# EAGLE design sx-wdec1-2313 (EAGLE 6.1)
Selectrix Arduino
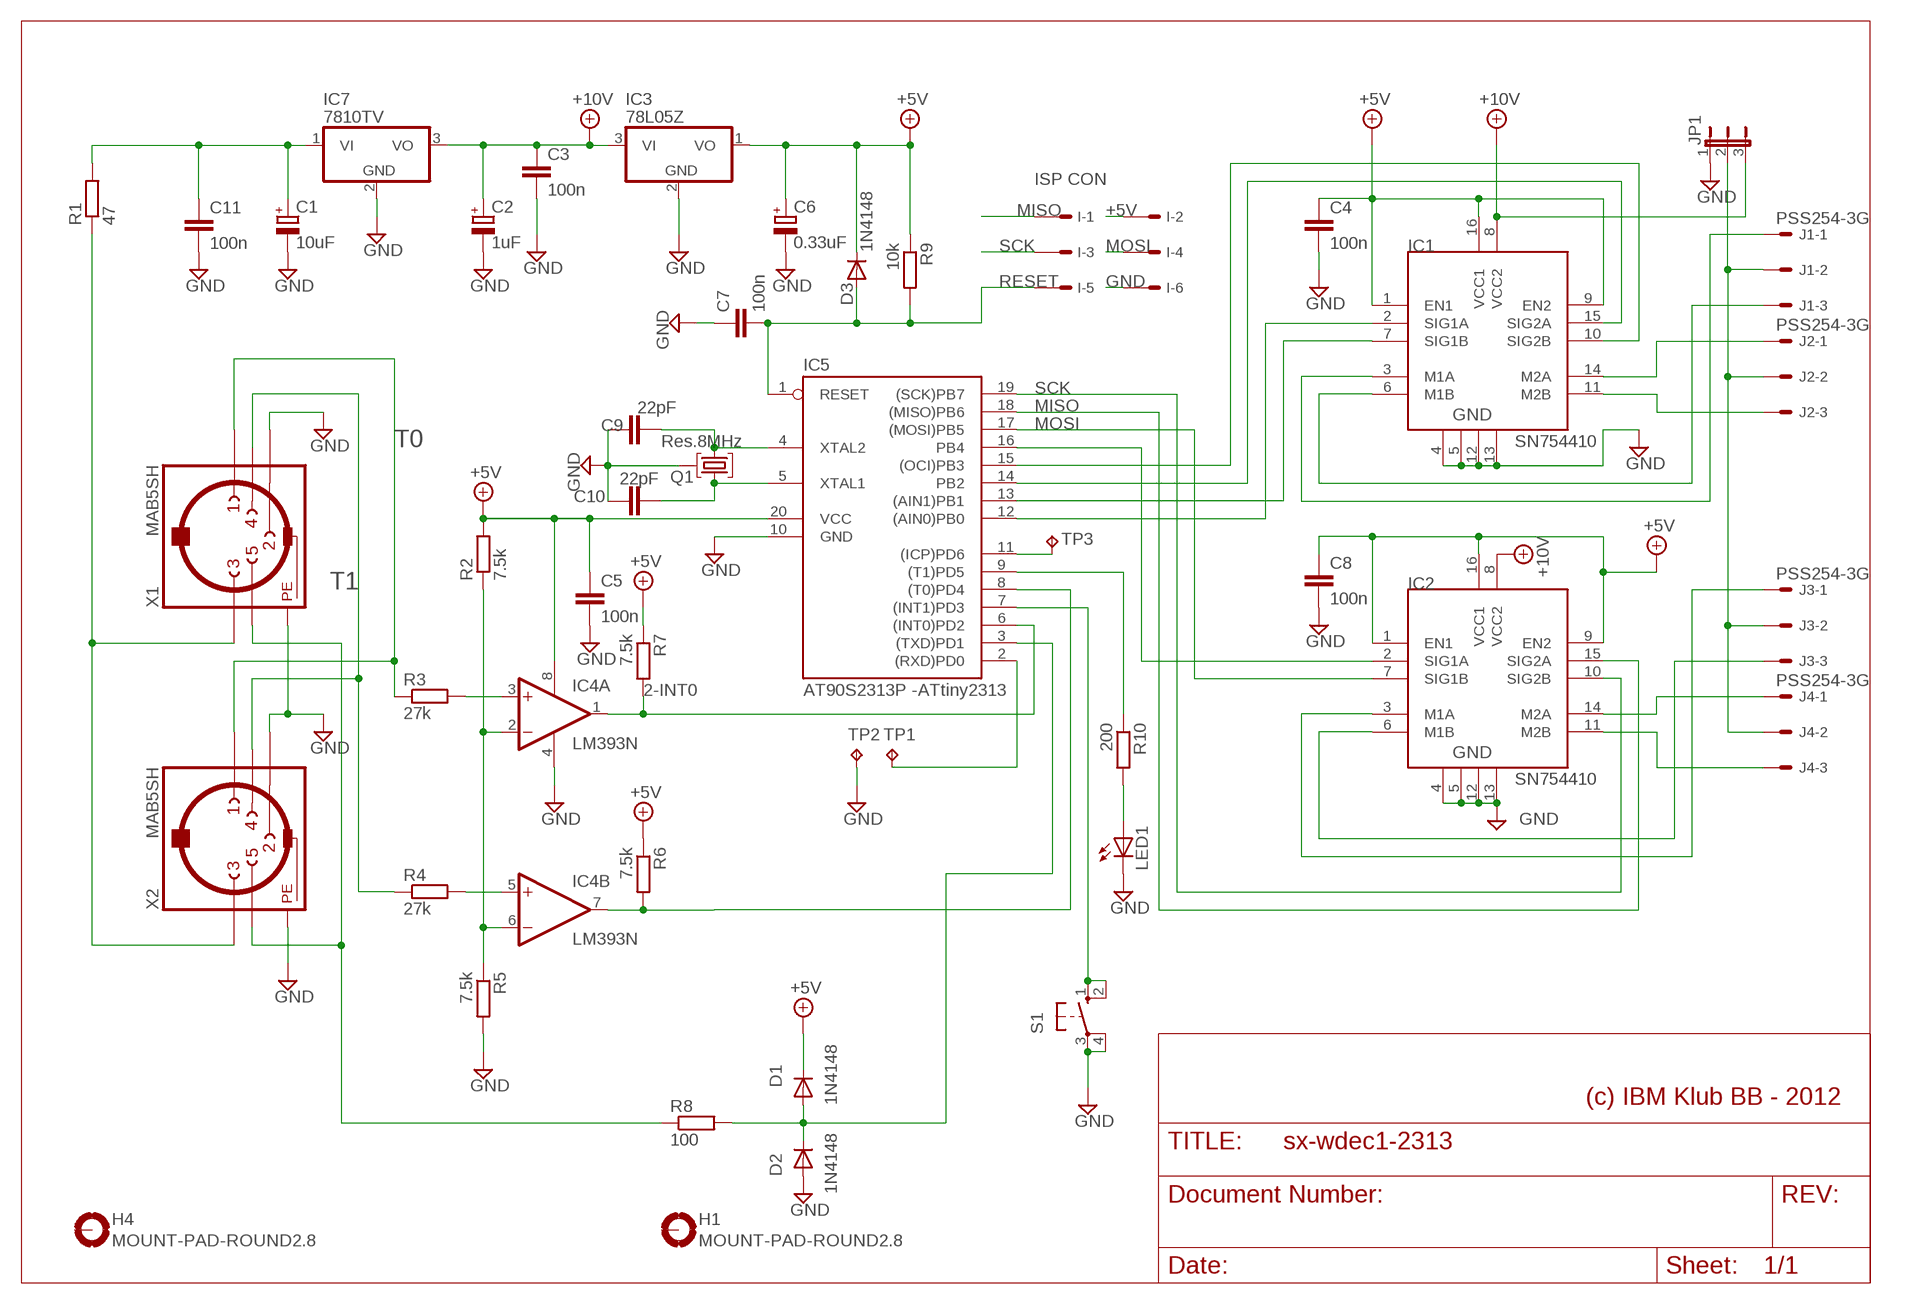
[diagram p0: schematic, sheet 1]

## Parts
C1  10uF  CPOL-EUE2.5-7  [E2,5-7]
C2  1uF  CPOL-EUE2.5-7  [E2,5-7]
C3  100n  C-EU050-025X075  [C050-025X075]
C4  100n  C-EU050-025X075  [C050-025X075]
C5  100n  C-EU050-025X075  [C050-025X075]
C6  0.33uF  CPOL-EUE2.5-5  [E2,5-5]
C7  100n  C-EU050-025X075  [C050-025X075]
C8  100n  C-EU050-025X075  [C050-025X075]
C9  22pF  C-EU025-025X050  [C025-025X050]
C10  22pF  C-EU025-025X050  [C025-025X050]
C11  100n  C-EU050-025X075  [C050-025X075]
D1  1N4148  1N4148DO35-7  [DO35-7]
D2  1N4148  1N4148DO35-7  [DO35-7]
D3  1N4148  1N4148DO35-7  [DO35-7]
H1  MOUNT-PAD-ROUND2.8  [2,8-PAD]
H4  MOUNT-PAD-ROUND2.8  [2,8-PAD]
I  ISP CON  057-006-1  [057-006-1]
IC1  SN754410  [DIP16]
IC2  SN754410  [DIP16]
IC3  78L05Z  [TO92]
IC4  LM393N  [DIL08]
IC5  AT90S2313P -ATtiny2313  AT90S2313P  [DIL20]
IC7  7810TV  7812TV  [TO220V]
J1  PSS254-3G  22-27-2031-03  [6410-03]
J2  PSS254-3G  22-27-2031-03  [6410-03]
J3  PSS254-3G  22-27-2031-03  [6410-03]
J4  PSS254-3G  22-27-2031-03  [6410-03]
JP1  JP2E  [JP2]
LED1  LED3MM  [LED3MM]
Q1  Res.8MHz  ECSECS-10.7-15A  [HC49U]
R1  47  R-EU_0207/12  [0207/12]
R2  7.5k  R-EU_0207/10  [0207/10]
R3  27k  R-EU_0207/10  [0207/10]
R4  27k  R-EU_0207/10  [0207/10]
R5  7.5k  R-EU_0207/10  [0207/10]
R6  7.5k  R-EU_0207/10  [0207/10]
R7  7.5k  R-EU_0207/10  [0207/10]
R8  100  R-EU_0207/10  [0207/10]
R9  10k  R-EU_0207/10  [0207/10]
R10  200  R-EU_0207/10  [0207/10]
S1  10-XX  [B3F-10XX]
TP1  TPPAD1-13  [P1-13]
TP2  TPPAD1-13  [P1-13]
TP3  TPPAD1-13  [P1-13]
X1  MAB5SH  [MAB5SH]
X2  MAB5SH  [MAB5SH]

## Nets
2-INT0: IC4.1(A:OUT) IC5.6((INT0)PD2) R7.2
4: IC4.7(B:OUT) IC5.8((T0)PD4) R6.2
6: IC1.15(SIG2A) IC5.14(PB2)
9: IC1.10(SIG2B) IC5.15((OCI)PB3)
10: IC2.2(SIG1A) IC5.16(PB4)
+5V: C4.1 C5.1 C6.+ C8.1 D1.C D3.C I.2 IC1.1(EN1) IC1.9(EN2) IC1.16(VCC1) IC2.1(EN1) IC2.9(EN2) IC2.16(VCC1) IC3.1(VO) IC4.8(P:V+) IC5.20(VCC) R2.2 R6.1 R7.1 R9.1
+10V: C2.+ C3.1 IC1.8(VCC2) IC2.8(VCC2) IC3.3(VI) IC7.3(VO) JP1.3
GND: C1.- C2.- C3.2 C4.2 C5.2 C6.- C7.1 C8.2 C9.1 C10.1 C11.2 D2.A I.6 IC1.4 IC1.5 IC1.12 IC1.13 IC2.4 IC2.5 IC2.12 IC2.13 IC3.2(GND) IC4.4(P:V-) IC5.10(GND) IC7.2(GND) JP1.1 LED1.K(C) Q1.2 R5.2 S1.3(P) S1.4(P1) TP2.TP X1.2 X1.PE X1.PE@(PE) X2.2 X2.PE X2.PE@(PE)
MISO: I.1 IC2.15(SIG2A) IC5.18((MISO)PB6)
MOSI: I.4 IC2.7(SIG1B) IC5.17((MOSI)PB5)
N$1: R1.1 X1.3 X2.3
N$2: C1.+ C11.1 IC7.1(VI) R1.2
N$3: R8.1 X1.5 X2.5
N$4: IC4.3(A:+IN) R3.2
N$5: IC4.5(B:+IN) R4.2
N$6: D1.A D2.C IC5.3((TXD)PD1) R8.2
N$7: IC4.2(A:-IN) IC4.6(B:-IN) R2.1 R5.1
N$8: IC1.2(SIG1A) IC5.12((AIN0)PB0)
N$9: IC1.3(M1A) J1.1
N$10: IC1.6(M1B) J1.3
N$11: IC1.14(M2A) J2.1
N$12: IC1.11(M2B) J2.3
N$13: IC2.3(M1A) J3.1
N$14: IC2.6(M1B) J3.3
N$15: IC2.14(M2A) J4.1
N$16: IC2.11(M2B) J4.3
N$17: C9.2 IC5.4(XTAL2) Q1.1
N$18: C10.2 IC5.5(XTAL1) Q1.3
N$19: IC1.7(SIG1B) IC5.13((AIN1)PB1)
N$20: IC5.2((RXD)PD0) TP1.TP
N$21: IC5.7((INT1)PD3) S1.1(S) S1.2(S1)
N$22: J1.2 J2.2 J3.2 J4.2 JP1.2
N$23: IC5.9((T1)PD5) R10.1
N$24: LED1.A R10.2
N$25: IC5.11((ICP)PD6) TP3.TP
RESET: C7.2 D3.A I.5 IC5.1(RESET) R9.2
SCK: I.3 IC2.10(SIG2B) IC5.19((SCK)PB7)
T0: R3.1 X1.1 X2.1
T1: R4.1 X1.4 X2.4
Unconnected: H1.B2,8(MOUNT) H4.B2,8(MOUNT)

## Notes on the sheet
- (c) IBM Klub BB - 2012

## Library data of the parts
C1 C2 C6 = rcl:CPOL-EU: POLARIZED CAPACITOR, European symbol
C3-C5 C7-C11 = rcl:C-EU: CAPACITOR, European symbol
D1-D3 = diode:1N4148: DIODE high speed (Philips)
H1 H4 = holes:MOUNT-PAD-ROUND: MOUNTING PAD, round
I = con-panduit:057-006-: CONNECTOR 6-pin series 057 contact pc board low profile headers; OC_FARNELL: unknown; OC_NEWARK: unknown
IC1 IC2 = HBridge:SN754410: Quadruple half-H driver
IC3 IC7 = linear:78*: Positive VOLTAGE REGULATOR Source: http://cache.national.com/ds/LM/LM78L05.pdf http://www.fairchildsemi.com/ds/LM/LM7805.pdf
IC4 = linear:LM393: COMPARATOR
IC5 = atmel:AT90S2313: MICROCONTROLLER 2 Kbytes FLASH 128 bytes SRAM 128 bytes EEPROM UART; OC_FARNELL: unknown; OC_NEWARK: unknown
J1-J4 = con-molex:22-?-03: CONNECTOR wire to board 2.54 mm (.1 inch) pitch header; OC_FARNELL: unknown; OC_NEWARK: unknown
JP1 = jumper:JP2E: JUMPER
LED1 = led:LED: LED OSRAM: - CHIPLED LG R971, LG N971, LY N971, LG Q971, LY Q971, LO R971, LY R971 LH N974, LH R974 LS Q976, LO Q976, LY Q976 LO Q996 - Hyper CHIPLED LW Q18S LB Q993, LB Q99A, LB R99A - SideLED LS A670, LO A670, LY A670, LG A670, LP A670 LB A673, LV A673, LT A673, LW A673 LH A674 LY A675 LS A676, LA A676, LO A676, LY A676, LW A676 LS A679, LY A679, LG A679 - Hyper Micro SIDELED® LS Y876, LA Y876, LO Y876, LY Y876 LT Y87S - SmartLED LW L88C, LW L88S LB L89C, LB L89S, LG L890 LS L89K, LO L89K, LY L89K LS L896, LA L896, LO L896, LY L896 - TOPLED LS T670, LO T670, LY T670, LG T670, LP T670 LSG T670, LSP T670, LSY T670, LOP T670, LYG T670 LG T671, LOG T671, LSG T671 LB T673, LV T673, LT T673, LW T673 LH T674 LS T676, LA T676, LO T676, LY T676, LB T676, LH T676, LSB T676, LW T676 LB T67C, LV T67C, LT T67C, LS T67K, LO T67K, LY T67K, LW E67C LS E67B, LA E67B, LO E67B, LY E67B, LB E67C, LV E67C, LT E67C LW T67C LS T679, LY T679, LG T679 LS T770, LO T770, LY T770, LG T770, LP T770 LB T773, LV T773, LT T773, LW T773 LH T774 LS E675, LA E675, LY E675, LS T675 LS T776, LA T776, LO T776, LY T776, LB T776 LHGB T686 LT T68C, LB T68C - Hyper Mini TOPLED® LB M676 - Mini TOPLED Santana® LG M470 LS M47K, LO M47K, LY M47K Source: http://www.osram.convergy.de LUXEON: - LUMILED® LXK2-PW12-R00, LXK2-PW12-S00, LXK2-PW14-U00, LXK2-PW14-V00 LXK2-PM12-R00, LXK2-PM12-S00, LXK2-PM14-U00 LXK2-PE12-Q00, LXK2-PE12-R00, LXK2-PE12-S00, LXK2-PE14-T00, LXK2-PE14-U00 LXK2-PB12-K00, LXK2-PB12-L00, LXK2-PB12-M00, LXK2-PB14-N00, LXK2-PB14-P00, LXK2-PB14-Q00 LXK2-PR12-L00, LXK2-PR12-M00, LXK2-PR14-Q00, LXK2-PR14-R00 LXK2-PD12-Q00, LXK2-PD12-R00, LXK2-PD12-S00 LXK2-PH12-R00, LXK2-PH12-S00 LXK2-PL12-P00, LXK2-PL12-Q00, LXK2-PL12-R00 Source: www.luxeon.com KINGBRIGHT: KA-3528ASYC Source: www.kingbright.com
Q1 = crystal:ECS: MONOLITHIC CRYSTAL FILTERS Source: http://www.presto.co.uk; OC_FARNELL: unknown; OC_NEWARK: unknown
R1-R10 = rcl:R-EU_: RESISTOR, European symbol
S1 = switch-omron:10-XX: OMRON SWITCH; MPN: B3F-1000; OC_FARNELL: 176432; OC_NEWARK: 36M3542
TP1-TP3 = testpad:TP: Test pad
X1 X2 = con-hirschmann:MAB5SH: Female CONNECTOR 5 pins 90 deg. with shield, horizontal (DIN 41524); OC_FARNELL: 809883; OC_NEWARK: unknown

## Board
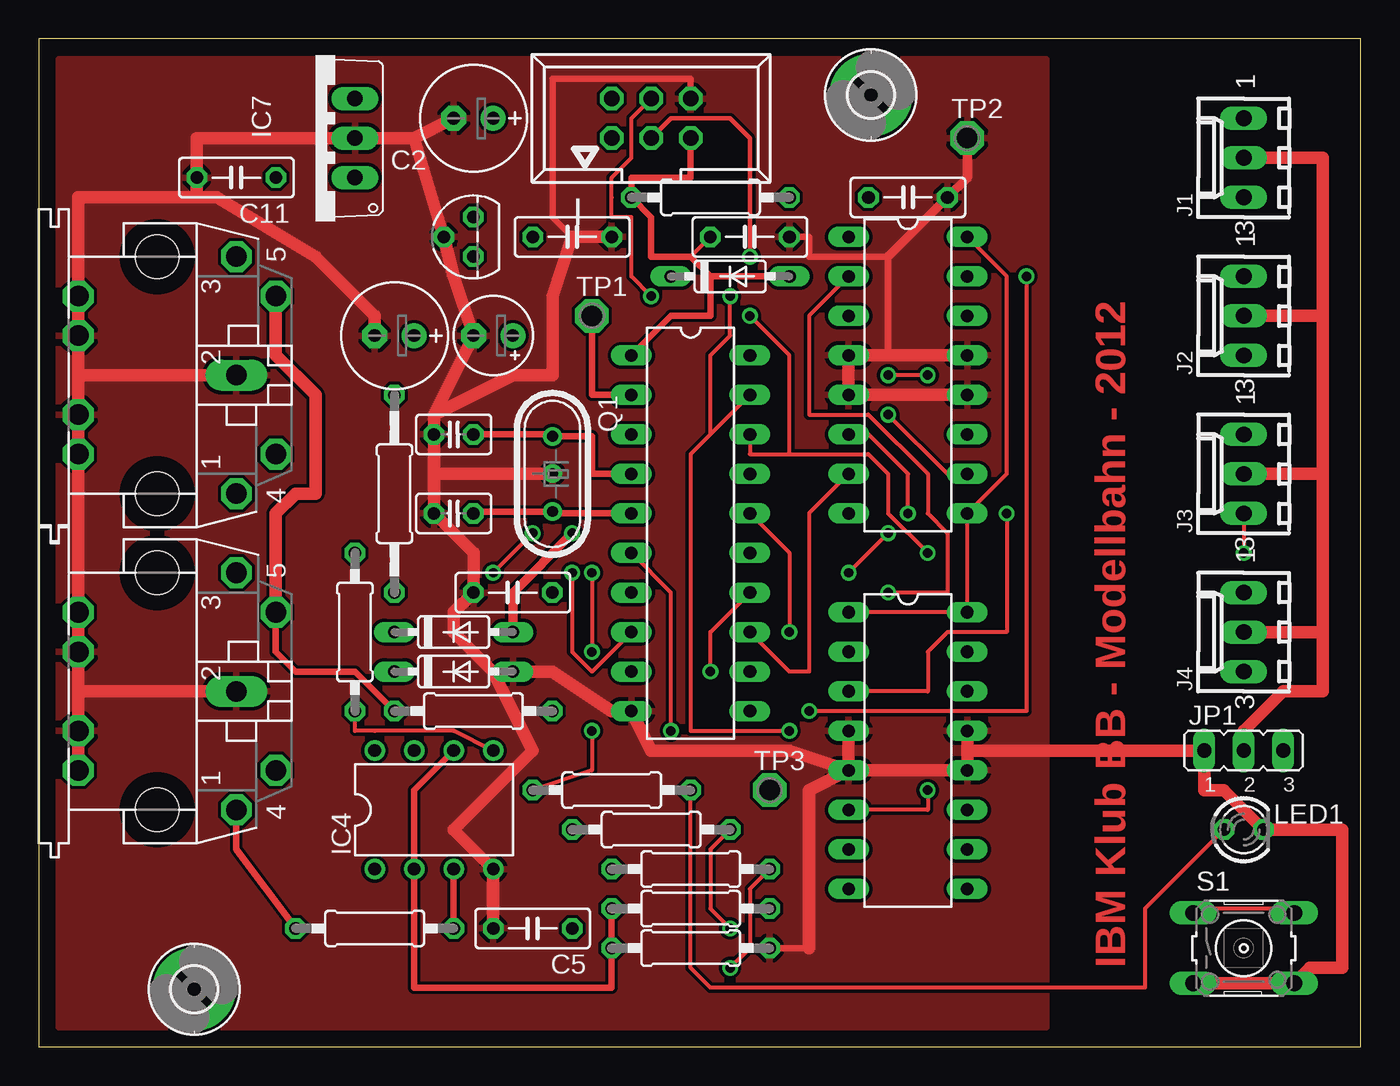
[diagram p1: board, top side]
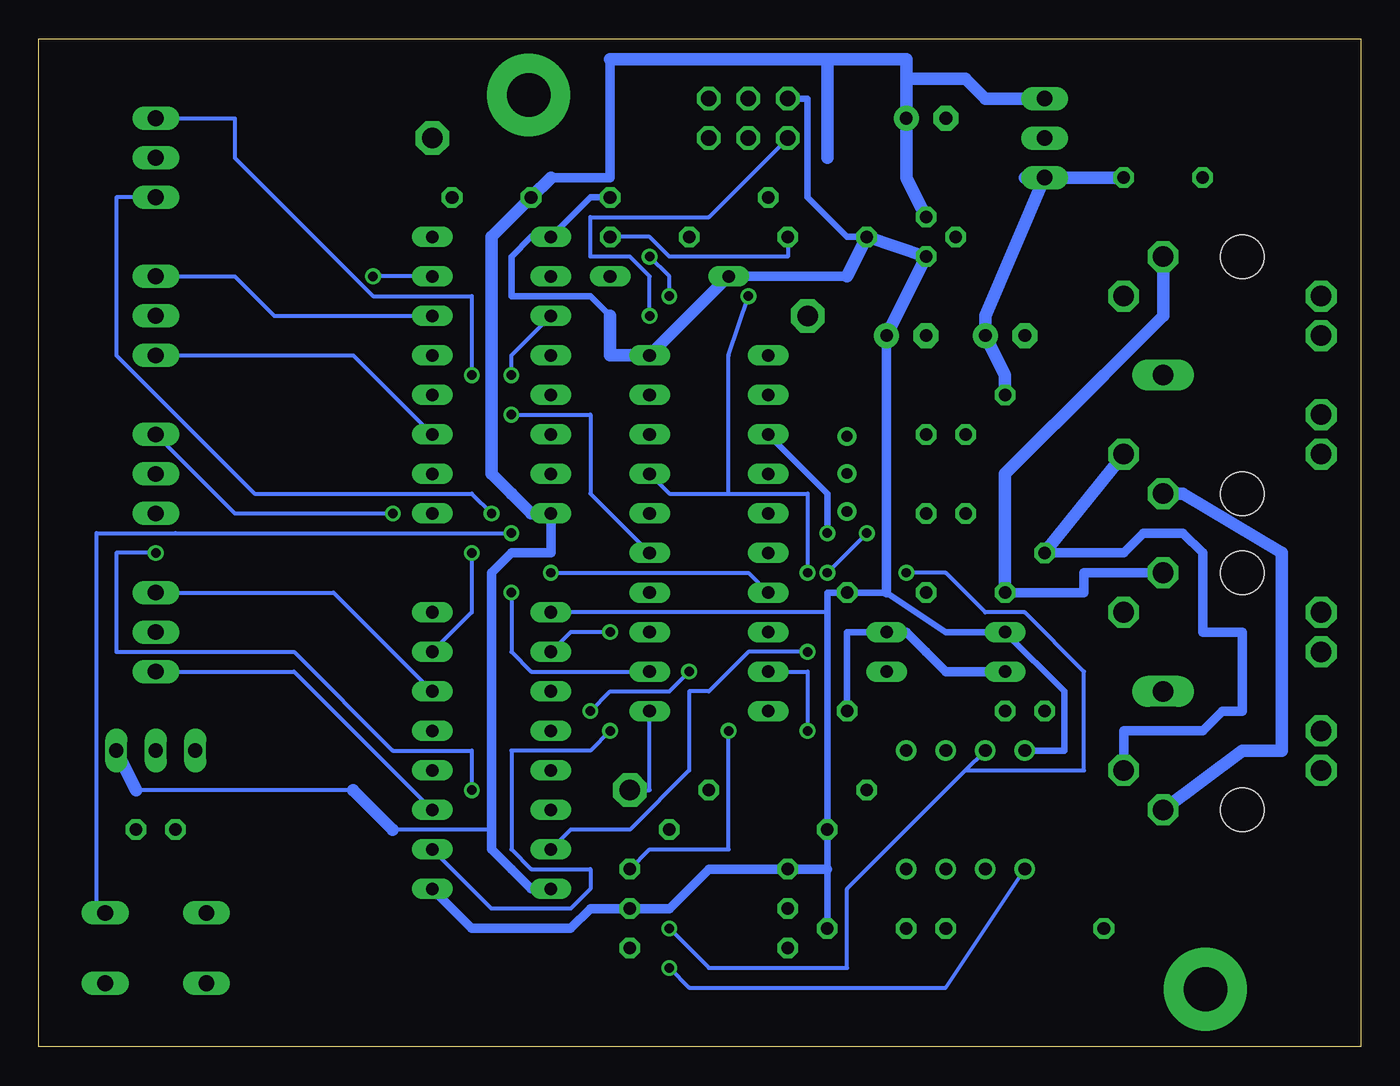
[diagram p2: board, bottom side, seen from below]

Size 84.99 x 64.8 mm. Coordinates in mm from the lower left corner, seen from the top.
Outline: 0,0 84.99,0 84.99,64.8 0,64.8 0,0
Copper layers (1*16): Top 0.035mm / dielectric 1.5mm / Bottom 0.035mm
Design rules: minimum track width 10mil, minimum drill 24mil, track to track 8mil, track to pad 8mil, pad to pad 8mil, via to via 8mil, smd to smd 8mil, copper to edge 40mil, drill to drill 8mil, minimum pad ring 10mil, minimum via ring 8mil, stop-mask expansion 4mil, vias tented up to drill 0mil, thermal gap 10mil

### Footprints (pad centres in the part's own frame; a part is rotated, then mirrored left to right if it is on the bottom)
E2,5-7 = drill 0.813 pad 1.6: + -1.27,0 | drill 0.813 pad 1.6 octagon: - 1.27,0
C050-025X075 = drill 0.813 octagon: 1 -2.54,0; 2 2.54,0
E2,5-5 = drill 0.813 pad 1.6: + -1.27,0 | drill 0.813 pad 1.6 octagon: - 1.27,0
C025-025X050 = drill 0.813 octagon: 1 -1.27,0; 2 1.27,0
DO35-7 = drill 0.813 long: A 3.81,0; C -3.81,0
2,8-PAD = drill 2.8 pad 5.334: B2,8 0,0
057-006-1 = drill 1 octagon: 1 -2.54,-1.27; 2 -2.54,1.27; 3 0,-1.27; 4 0,1.27; 5 2.54,-1.27; 6 2.54,1.27
DIP16 = drill 0.813 long: 1 -10.16,-3.81; 2 -7.62,-3.81; 3 -5.08,-3.81; 4 -2.54,-3.81; 5 0,-3.81; 6 2.54,-3.81; 7 5.08,-3.81; 8 7.62,-3.81; 9 7.62,3.81; 10 5.08,3.81; 11 2.54,3.81; 12 0,3.81; 13 -2.54,3.81; 14 -5.08,3.81; 15 -7.62,3.81; 16 -10.16,3.81
TO92 = drill 0.813 octagon: 1 -1.27,0; 2 0,1.905; 3 1.27,0
DIL08 = drill 0.813 pad 1.27: 1 -3.81,-3.81; 2 -1.27,-3.81; 3 1.27,-3.81; 4 3.81,-3.81; 5 3.81,3.81; 6 1.27,3.81; 7 -1.27,3.81; 8 -3.81,3.81
DIL20 = drill 0.813 long: 1 -11.43,-3.81; 2 -8.89,-3.81; 3 -6.35,-3.81; 4 -3.81,-3.81; 5 -1.27,-3.81; 6 1.27,-3.81; 7 3.81,-3.81; 8 6.35,-3.81; 9 8.89,-3.81; 10 11.43,-3.81; 11 11.43,3.81; 12 8.89,3.81; 13 6.35,3.81; 14 3.81,3.81; 15 1.27,3.81; 16 -1.27,3.81; 17 -3.81,3.81; 18 -6.35,3.81; 19 -8.89,3.81; 20 -11.43,3.81
TO220V = drill 1.016 long: 1 -2.54,-2.54; 2 0,-2.54; 3 2.54,-2.54
6410-03 = drill 1.016 long: 1 2.54,0; 2 0,0; 3 -2.54,0
JP2 = drill 0.914 long: 1 -2.54,0; 2 0,0; 3 2.54,0
LED3MM = drill 0.813 octagon: A -1.27,0; K 1.27,0
HC49U = drill 0.7 pad 1.2: 1 -2.413,0; 2 -0.027,0; 3 2.413,0
0207/12 = drill 0.813 octagon: 1 -6.35,0; 2 6.35,0
0207/10 = drill 0.813 octagon: 1 -5.08,0; 2 5.08,0
B3F-10XX = drill 1.016 long: 1 -3.251,2.261; 2 3.251,2.261; 3 -3.251,-2.261; 4 3.251,-2.261
P1-13 = drill 1.321 pad 2.159 octagon: TP 0,0
MAB5SH = drill 1.321 octagon: 1 7.62,5.08; 3 -7.62,5.08; 4 5.08,7.62; 5 -5.08,7.62; PE -2.54,-5.08; PE@ 2.54,-5.08; PE@2 -5.08,-5.08; PE@3 5.08,-5.08 | drill 1.321 long: 2 0,5.08 | hole 2.794: 7.62,0; -7.62,0

### Placement (x,y rotation side)
C1  22.86,45.72 180 top
C2  27.94,59.69 180 top
C3  55.88,54.61 0 top
C4  34.29,52.07 0 top
C5  31.75,7.62 180 top
C6  29.21,45.72 180 top
C7  45.72,52.07 180 top
C8  30.48,29.21 180 top
C9  26.67,39.37 0 top
C10  26.67,34.29 0 top
C11  12.7,55.88 180 top
D1  26.67,26.67 0 top
D2  26.67,24.13 0 top
D3  44.45,49.53 0 top
H1  53.49,61.19 0 top
H4  9.98,3.71 0 top
I  39.37,59.69 0 top
IC1  55.88,41.91 270 top
IC2  55.88,17.78 270 top
IC3  27.94,52.07 90 top
IC4  25.4,15.24 0 top
IC5  41.91,33.02 270 top
IC7  17.78,58.42 90 top
J1  77.47,57.15 90 top
J2  77.47,46.99 90 top
J3  77.47,36.83 90 top
J4  77.47,26.67 90 top
JP1  77.47,19.05 0 top
LED1  77.47,13.97 0 top
Q1  33.02,36.83 270 top
R1  22.86,35.56 90 top
R2  41.91,8.89 0 top
R3  21.59,7.62 0 top
R4  20.32,26.67 270 top
R5  41.91,6.35 0 top
R6  39.37,13.97 0 top
R7  41.91,11.43 0 top
R8  27.94,21.59 0 top
R9  43.18,54.61 180 top
R10  36.83,16.51 0 top
S1  77.47,6.35 0 top
TP1  35.56,46.99 0 top
TP2  59.69,58.42 0 top
TP3  46.99,16.51 0 top
X1  7.62,43.18 270 top
X2  7.62,22.86 270 top

### Tracks (layer width: path | path; a pad name or v marks a point on that pad's centre or on a via)
2-INT0  (via drill 0.61)
  Top 0.254: IC5.6 40.64,29.21 v40.64,20.32 | v44.45,5.08 45.72,6.35 45.72,10.16 R7.2
  Bottom 0.254: R7.2 45.72,12.7 40.64,12.7 v40.64,20.32 | IC4.1 26.67,3.81 43.18,3.81 v44.45,5.08
4  (via drill 0.61)
  Top 0.254: v44.45,7.62 43.18,8.89 43.18,12.7 R6.2 | IC5.8 35.56,24.13 34.29,25.4 v34.29,30.48 | v29.21,30.48 v31.75,33.02
  Bottom 0.254: 25.4,17.78 33.02,10.16 33.02,5.08 41.91,5.08 v44.45,7.62 | 25.4,17.78 IC4.7 | v31.75,33.02 v34.29,30.48 | v29.21,30.48 26.67,30.48 24.13,27.94 21.59,27.94 17.78,24.13 17.78,17.78 25.4,17.78
6  (via drill 0.61)
  Top 0.254: IC5.14 43.18,26.67 v43.18,24.13 | v49.53,21.59 63.5,21.59 v63.5,49.53
  Bottom 0.254: v43.18,24.13 44.45,22.86 48.26,22.86 v49.53,21.59 | IC1.15 v63.5,49.53
9  (via drill 0.61)
  Top 0.254: v54.61,40.64 58.42,36.83 IC1.10
  Bottom 0.254: IC5.15 49.53,35.56 49.53,40.64 v54.61,40.64
10  (via drill 0.61)
  Top 0.254: v48.26,26.67 48.26,31.75 IC5.16
  Bottom 0.254: IC2.2 50.8,26.67 v48.26,26.67
+5V
  Top 0.254: IC2.1 IC2.16 IC1.9 62.23,36.83 62.23,49.53 IC1.16
  Bottom 0.254: 34.29,27.94 IC2.1
  Bottom 0.406: C4.1 33.02,52.07 35.56,54.61 35.56,60.96 I.2 | 48.26,46.99 49.53,48.26 54.61,48.26 54.61,50.8 53.34,52.07 IC1.1 49.53,54.61 R9.1 | C5.1 34.29,11.43 R6.1 34.29,27.94 34.29,29.21 C8.1 30.48,29.21 26.67,26.67 D1.C 19.05,22.86 19.05,19.05 IC4.8
  Bottom 0.61: D3.C 33.02,49.53 | 34.29,11.43 R7.1 41.91,11.43 44.45,8.89 R2.2 49.53,8.89 50.8,7.62 57.15,7.62 IC2.9 | C6.+ 30.48,44.45 30.48,43.18 30.48,29.21
  Bottom 0.813: IC5.20 48.26,44.45 | 48.26,44.45 IC5.20 | IC5.20 D3.C | 33.02,49.53 C4.1 IC3.1 C6.+ | 48.26,44.45 48.26,46.99
+10V
  Bottom 0.254: 55.88,13.97 62.23,13.97 | 64.77,16.51 78.74,16.51
  Bottom 0.61: 48.26,63.5 48.26,55.88 52.07,55.88 | IC1.8 52.07,31.75 54.61,31.75 55.88,30.48 55.88,13.97 55.88,12.7 54.61,11.43 53.34,10.16 IC2.8
  Bottom 0.813: 34.29,57.15 34.29,63.5 | 34.29,63.5 48.26,63.5 | 52.07,55.88 C3.1 55.88,52.07 55.88,36.83 54.61,35.56 53.34,34.29 IC1.8 | IC7.3 24.13,60.96 25.4,62.23 29.21,62.23 | 29.21,62.23 C2.+ 29.21,55.88 IC3.3 | 29.21,62.23 29.21,63.5 34.29,63.5 | 78.74,16.51 JP1.3 | 62.23,13.97 64.77,16.51
GND
  Top 0.406: 41.91,62.23 I.6 41.91,62.23 | C7.1 49.53,52.07 49.53,50.8 54.61,50.8 54.61,44.45 | R5.2 49.53,6.35 | 41.91,62.23 33.02,62.23 33.02,53.34 34.29,52.07 C4.2
  Top 0.61: TP2.TP 59.69,55.88 C3.2 54.61,50.8
  Top 0.813: 2.54,22.86 X2.PE | 2.54,43.18 X1.PE@ 2.54,22.86 | 2.54,43.18 X1.PE | X1.2 2.54,43.18 | X1.2 2.54,43.18 | 2.54,43.18 2.54,52.07 2.54,54.61 | 10.16,54.61 C11.2 | C11.2 10.16,58.42 IC7.2 24.13,58.42 | 25.4,40.64 30.48,43.18 33.02,43.18 33.02,48.26 34.29,52.07 C4.2 | 25.4,40.64 C9.1 25.4,36.83 | 25.4,36.83 C10.1 27.94,31.75 C8.2 26.67,27.94 26.67,26.67 29.21,24.13 | Q1.2 25.43,36.86 25.4,36.83 | 29.21,24.13 D2.A 33.02,24.13 36.83,21.59 IC5.10 39.37,19.05 48.26,19.05 IC2.5 | 29.21,24.13 31.75,19.05 26.67,13.97 IC4.4 29.21,10.16 C5.2 | IC2.13 59.69,19.05 | 59.69,19.05 IC2.12 IC2.5 | IC1.13 54.61,44.45 IC1.4 IC1.5 IC1.12 | 59.69,19.05 JP1.1 74.93,16.51 76.2,16.51 LED1.K 83.82,13.97 83.82,5.08 81.71,5.08 S1.4 S1.3 | 49.53,6.35 49.53,16.51 IC2.5 | IC2.5 IC2.4 | 24.13,58.42 IC3.2 26.67,49.53 C6.- 25.4,40.64 | C2.- 24.13,58.42 | C1.- 21.59,46.99 17.78,50.8 11.43,54.61 | 11.43,54.61 10.16,54.61 | 10.16,54.61 11.43,54.61 | 11.43,54.61 10.16,54.61 | 10.16,54.61 C11.2 | C11.2 10.16,54.61 | X1.2 2.54,43.18 | 2.54,43.18 2.54,54.61 | 2.54,54.61 10.16,54.61 | 2.54,22.86 X2.PE@ | X2.PE@ 2.54,17.78 | X2.2 2.54,22.86 | 2.54,22.86 X2.PE@
  Bottom 0.254: C7.1 45.72,52.07 44.45,50.8 36.83,50.8 C4.2
  pour Top: 1.27,63.5 64.77,63.5 64.77,1.27 1.27,1.27
MISO  (via drill 0.61)
  Top 0.254: v57.15,31.75 54.61,34.29 54.61,36.83 53.34,38.1 48.26,38.1 | 48.26,38.1 45.72,38.1 IC5.18 | v45.72,46.99 48.26,44.45 48.26,38.1
  Bottom 0.254: IC2.15 57.15,27.94 v57.15,31.75 | I.1 41.91,53.34 49.53,53.34 49.53,50.8 46.99,50.8 45.72,49.53 v45.72,46.99
MOSI  (via drill 0.61)
  Top 0.254: v35.56,30.48 v35.56,25.4 | I.4 38.1,59.69 38.1,57.15 36.83,55.88 36.83,54.61 36.83,53.34 38.1,53.34 38.1,49.53 v39.37,48.26
  Bottom 0.254: IC2.7 50.8,13.97 46.99,13.97 43.18,17.78 43.18,22.86 41.91,22.86 39.37,25.4 v35.56,25.4 | v35.56,30.48 35.56,35.56 40.64,35.56 | 40.64,35.56 44.45,35.56 IC5.17 | v39.37,48.26 40.64,44.45 40.64,35.56
N$1
  Bottom 0.61: X2.3 17.78,30.48 17.78,29.21 R1.1
  Bottom 0.813: R1.1 22.86,36.83 16.51,43.18 12.7,46.99 X1.3
N$2
  Bottom 0.813: IC7.1 21.59,55.88 17.78,55.88 C11.1 IC7.1 | IC7.1 24.13,46.99 C1.+ 22.86,43.18 R1.2
N$3
  Top 0.406: X2.5 15.24,25.4 16.51,24.13 20.32,24.13 R8.1
  Top 0.813: X1.5 15.24,44.45 17.78,41.91 17.78,35.56 16.51,35.56 15.24,34.29 X2.5
N$4
  Top 0.406: IC4.3 26.67,8.89 R3.2
N$5
  Top 0.254: R4.2 20.32,20.32 21.59,20.32 26.67,20.32 IC4.5
N$6  (via drill 0.61)
  Top 0.61: v34.29,33.02 30.48,29.21 D1.A
  Bottom 0.406: D1.A 33.02,26.67 R8.2 | IC5.3 34.29,35.56 v34.29,33.02
  Bottom 0.61: D2.C 25.4,24.13 26.67,24.13 27.94,25.4 29.21,26.67 D1.A
N$7
  Top 0.406: R5.1 R2.1 36.83,3.81 24.13,3.81 IC4.2 24.13,15.24 24.13,16.51 IC4.6
N$8  (via drill 0.61)
  Top 0.254: v54.61,29.21 58.42,29.21 58.42,33.02 57.15,34.29 57.15,36.83 53.34,40.64 49.53,40.64 49.53,46.99 IC1.2
  Bottom 0.254: IC5.12 53.34,24.13 54.61,25.4 v54.61,29.21
N$9  (via drill 0.61)
  Top 0.254: v57.15,43.18 v54.61,43.18
  Bottom 0.254: IC1.3 54.61,44.45 v54.61,43.18 | v57.15,43.18 57.15,48.26 63.5,48.26 72.39,57.15 72.39,59.69 J1.1
N$10  (via drill 0.61)
  Top 0.254: IC1.6 53.34,39.37 55.88,36.83 v55.88,34.29
  Bottom 0.254: v55.88,34.29 57.15,35.56 71.12,35.56 80.01,44.45 80.01,54.61 J1.3
N$11
  Bottom 0.254: IC1.14 69.85,46.99 72.39,49.53 J2.1
N$12
  Bottom 0.254: IC1.11 64.77,44.45 J2.3
N$13  (via drill 0.61)
  Top 0.254: IC2.3 57.15,22.86 57.15,25.4 58.42,26.67 62.23,26.67 v62.23,34.29
  Bottom 0.254: v62.23,34.29 72.39,34.29 J3.1
N$14  (via drill 0.61)
  Top 0.254: IC2.6 57.15,15.24 v57.15,16.51 | J3.3 v77.47,31.75
  Bottom 0.254: v57.15,16.51 57.15,19.05 62.23,19.05 68.58,25.4 80.01,25.4 80.01,31.75 v77.47,31.75
N$15
  Bottom 0.254: IC2.14 66.04,29.21 J4.1
N$16
  Bottom 0.254: IC2.11 68.58,24.13 J4.3
N$17
  Top 0.406: C9.2 33.02,39.37 Q1.1 35.56,39.24 35.56,36.83 IC5.4
N$18
  Top 0.406: IC5.5 33.02,34.29 Q1.3 27.94,34.42 C10.2
N$19
  Top 0.254: IC5.13 48.26,24.13 49.53,24.13 49.53,34.29 IC1.7
N$20
  Top 0.406: IC5.2 35.56,41.91 TP1.TP
N$21  (via drill 0.61)
  Top 0.254: v54.61,33.02 v52.07,30.48 | S1.1 74.93,8.89 80.01,8.89 S1.2
  Bottom 0.254: IC5.7 39.37,30.48 v52.07,30.48 | v54.61,33.02 76.2,33.02 81.28,33.02 81.28,8.89 S1.2
N$22
  Top 0.254: 77.47,20.32 JP1.2
  Top 0.813: 82.55,46.99 82.55,57.15 J1.2 | 82.55,46.99 82.55,36.83 | 82.55,36.83 J3.2 82.55,36.83 | 82.55,36.83 82.55,26.67 | 82.55,26.67 82.55,22.86 80.01,22.86 77.47,20.32 | 82.55,46.99 J2.2 | J4.2 82.55,26.67
N$23  (via drill 0.61)
  Top 0.254: R10.1 35.56,17.78 v35.56,20.32
  Bottom 0.254: v35.56,20.32 35.56,24.13 IC5.9
N$24
  Top 0.254: LED1.A 71.12,8.89 71.12,3.81 43.18,3.81 41.91,5.08 R10.2
N$25
  Bottom 0.254: IC5.11 45.72,16.51 TP3.TP
RESET
  Top 0.254: 41.91,50.8 C7.2
  Top 0.406: I.5 41.91,55.88 38.1,55.88 R9.2 39.37,53.34 39.37,50.8 41.91,50.8 43.18,49.53 | 43.18,49.53 43.18,46.99 40.64,46.99 IC5.1 | D3.A 43.18,49.53
SCK  (via drill 0.61)
  Top 0.254: v48.26,20.32 41.91,20.32 41.91,38.1 43.18,39.37 | IC5.19 43.18,39.37 | v44.45,48.26 44.45,45.72 43.18,44.45 43.18,39.37
  Top 0.305: I.3 40.64,59.69 44.45,59.69 45.72,58.42 v45.72,50.8
  Bottom 0.254: IC2.10 55.88,8.89 50.8,8.89 49.53,10.16 49.53,11.43 53.34,11.43 54.61,12.7 54.61,19.05 49.53,19.05 v48.26,20.32 | v45.72,50.8 44.45,49.53 v44.45,48.26
T0
  Top 0.406: R3.1 12.7,12.7 X2.1
  Bottom 0.813: X1.1 11.43,35.56 5.08,31.75 5.08,26.67 5.08,25.4 5.08,19.05 7.62,19.05 X2.1
T1
  Bottom 0.61: R4.1 15.24,31.75 13.97,33.02 11.43,33.02 10.16,31.75 10.16,26.67 7.62,26.67 7.62,21.59 8.89,21.59 10.16,20.32 15.24,20.32 X2.4
  Bottom 0.813: R4.1 X1.4

### Text on the board
Top: IBM Klub BB - Modellbahn - 2012